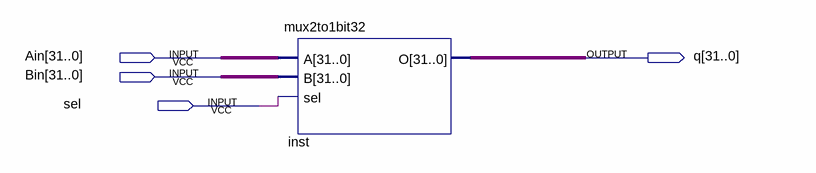
[diagram p0: schematic sheet]
// Quartus schematic CompTest.bdf as structural Verilog: 1 symbols, 4 pins
module CompTest (
  input  [31:0] Ain,
  input  [31:0] Bin,
  input  sel,
  output [31:0] q
);

  mux2to1bit32 inst (.A(Ain), .B(Bin), .sel(sel), .O(q));
endmodule
